# EAGLE design R111F (EAGLE 6.6.0)
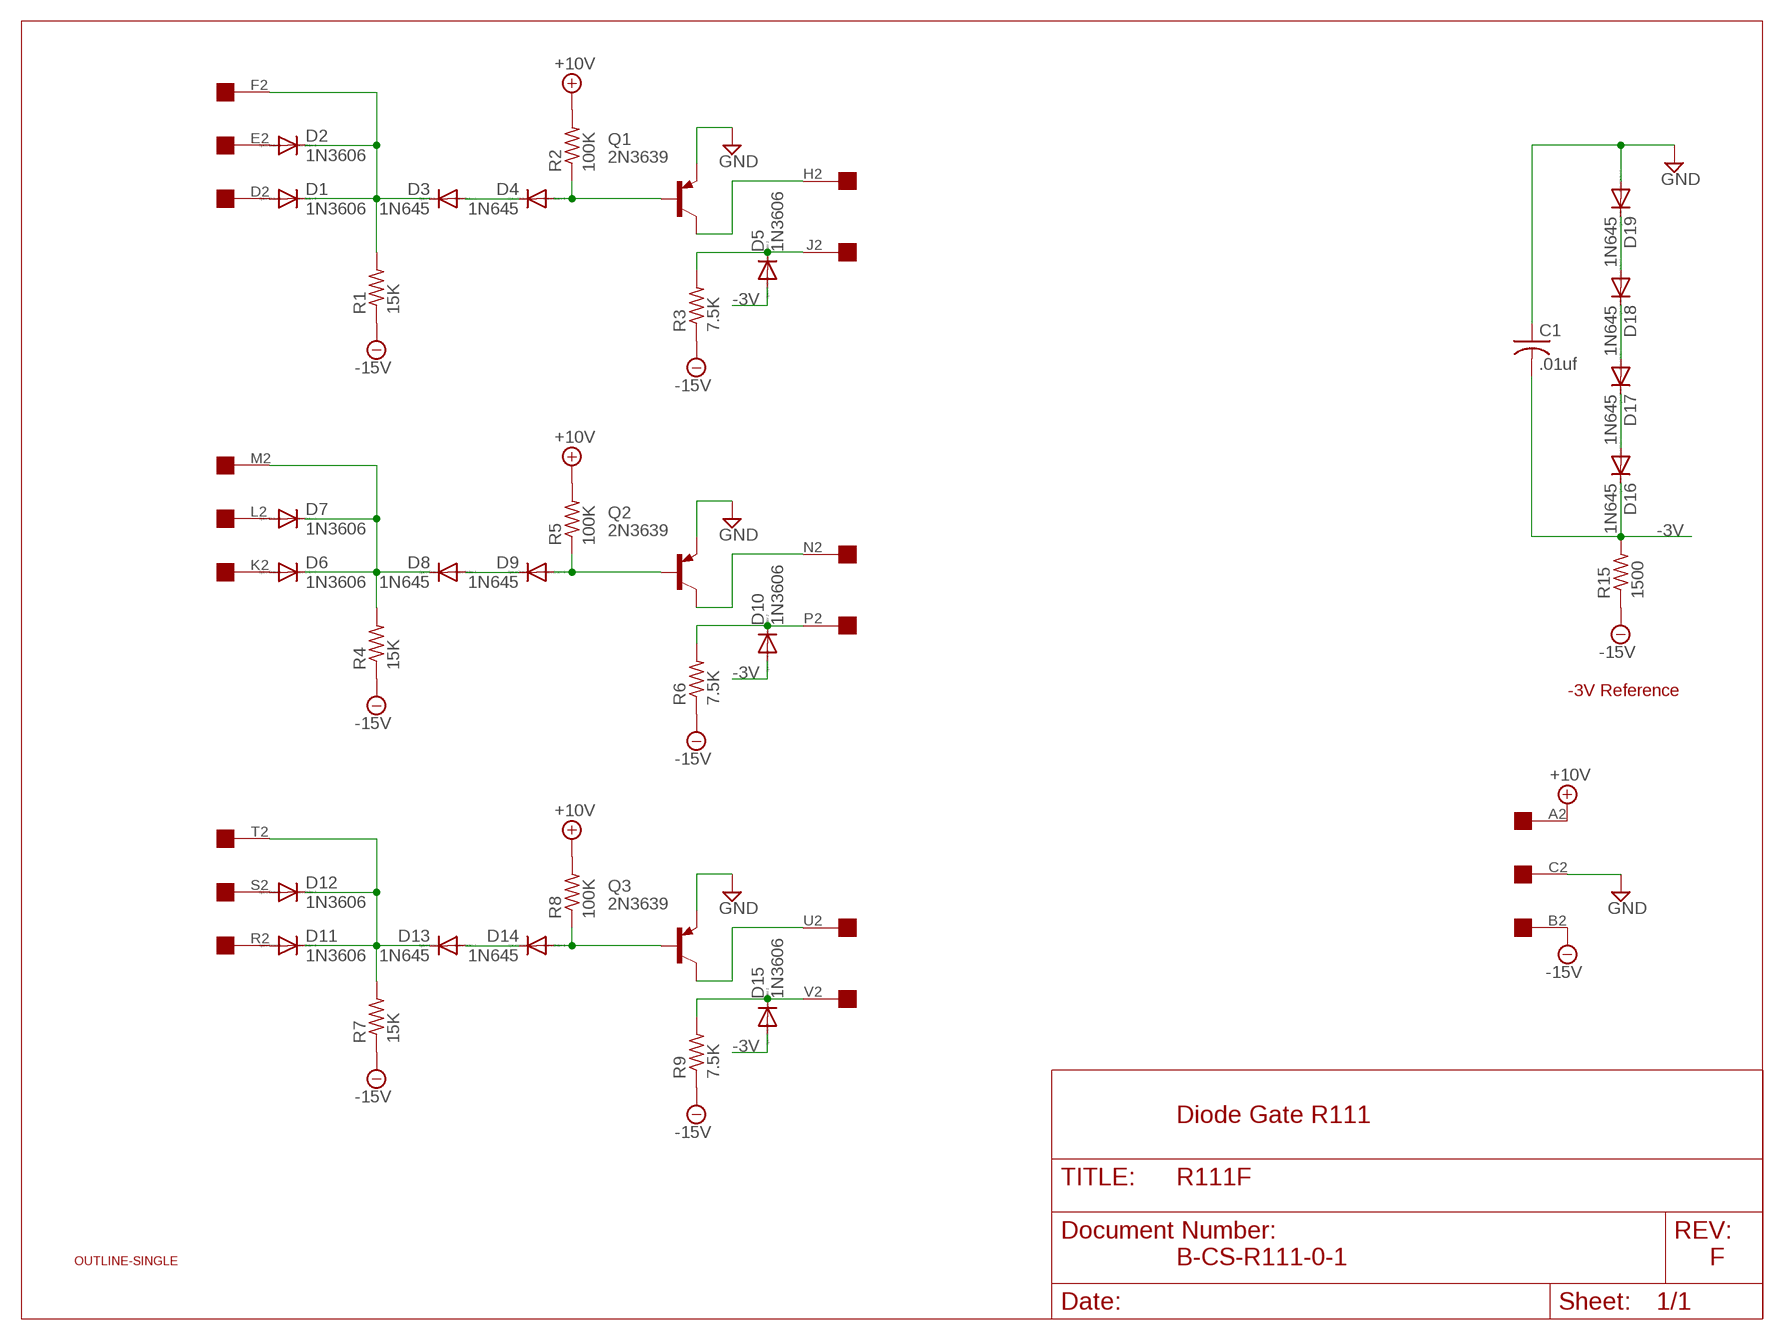
[diagram p0: schematic, sheet 1]

## Parts
C1  .01uf  C-US  [C063-025X075]
D1  1N3606  1N4148DO35-10  [DO35-10]
D2  1N3606  1N4148DO35-10  [DO35-10]
D3  1N645  1N4148DO35-10  [DO35-10]
D4  1N645  1N4148DO35-10  [DO35-10]
D5  1N3606  1N4148DO35-10  [DO35-10]
D6  1N3606  1N4148DO35-10  [DO35-10]
D7  1N3606  1N4148DO35-10  [DO35-10]
D8  1N645  1N4148DO35-10  [DO35-10]
D9  1N645  1N4148DO35-10  [DO35-10]
D10  1N3606  1N4148DO35-10  [DO35-10]
D11  1N3606  1N4148DO35-10  [DO35-10]
D12  1N3606  1N4148DO35-10  [DO35-10]
D13  1N645  1N4148DO35-10  [DO35-10]
D14  1N645  1N4148DO35-10  [DO35-10]
D15  1N3606  1N4148DO35-10  [DO35-10]
D16  1N645  1N4148DO35-10  [DO35-10]
D17  1N645  1N4148DO35-10  [DO35-10]
D18  1N645  1N4148DO35-10  [DO35-10]
D19  1N645  1N4148DO35-10  [DO35-10]
Q1  2N3639  2N3637  [TO39]
Q2  2N3639  2N3637  [TO39]
Q3  2N3639  2N3637  [TO39]
R1  15K  R-US_0207/10  [0207/10]
R2  100K  R-US_0207/10  [0207/10]
R3  7.5K  R-US_0207/10  [0207/10]
R4  15K  R-US_0207/10  [0207/10]
R5  100K  R-US_0207/10  [0207/10]
R6  7.5K  R-US_0207/10  [0207/10]
R7  15K  R-US_0207/10  [0207/10]
R8  100K  R-US_0207/10  [0207/10]
R9  7.5K  R-US_0207/10  [0207/10]
R15  1500  R-US_0207/10  [0207/10]
U$1  OUTLINE-SINGLE  [SINGLE]
U$2  EDGE-1  [EDGE-CON1]

## Nets
+10V [Power]: R2.2 R5.2 R8.2 U$2.A2
-3V [Power]: C1.2 D5.A D10.A D15.A D16.C R15.2
-15V [Power]: R1.1 R3.1 R4.1 R6.1 R7.1 R9.1 R15.1 U$2.B2
GND [Power]: C1.1 D19.A Q1.1(E) Q2.1(E) Q3.1(E) U$2.C2
N$1: D6.A U$2.K2
N$2: D9.A Q2.2(B) R5.1
N$3: D18.A D19.C
N$4: D10.C R6.2 U$2.P2
N$5: Q1.3(C) U$2.H2
N$6: D6.C D7.C D8.C R4.2 U$2.M2
N$7: D8.A D9.C
N$8: D14.A Q3.2(B) R8.1
N$9: D15.C R9.2 U$2.V2
N$10: D11.A U$2.R2
N$11: D11.C D12.C D13.C R7.2 U$2.T2
N$12: D13.A D14.C
N$13: D17.A D18.C
N$14: D7.A U$2.L2
N$15: Q2.3(C) U$2.N2
N$16: D16.A D17.C
N$17: Q3.3(C) U$2.U2
N$19: D4.A Q1.2(B) R2.1
N$20: D5.C R3.2 U$2.J2
N$21: D1.A U$2.D2
N$22: D1.C D2.C D3.C R1.2 U$2.F2
N$23: D3.A D4.C
N$31: D12.A U$2.S2
N$39: D2.A U$2.E2

## Notes on the sheet
- -3V Reference
- Diode Gate R111
- B-CS-R111-0-1 | F

## Library data of the parts
C1 = dec-con:C-US: Capacitors with funky DEC lead spacing.
D1-D19 = diode:1N4148: DIODE high speed (Philips)
Q1-Q3 = transistor-pnp:2N3637*: PNP Transistror
R1-R9 R15 = rcl:R-US_: RESISTOR, American symbol
U$1 = dec-con:OUTLINE-*: Board outlines for DEC boards.
U$2 = dec-con:EDGE-1: Single-Sided DEC Edge Connector -- (side 2)

## Net classes
1 Power: width 0.813 mm

## Board
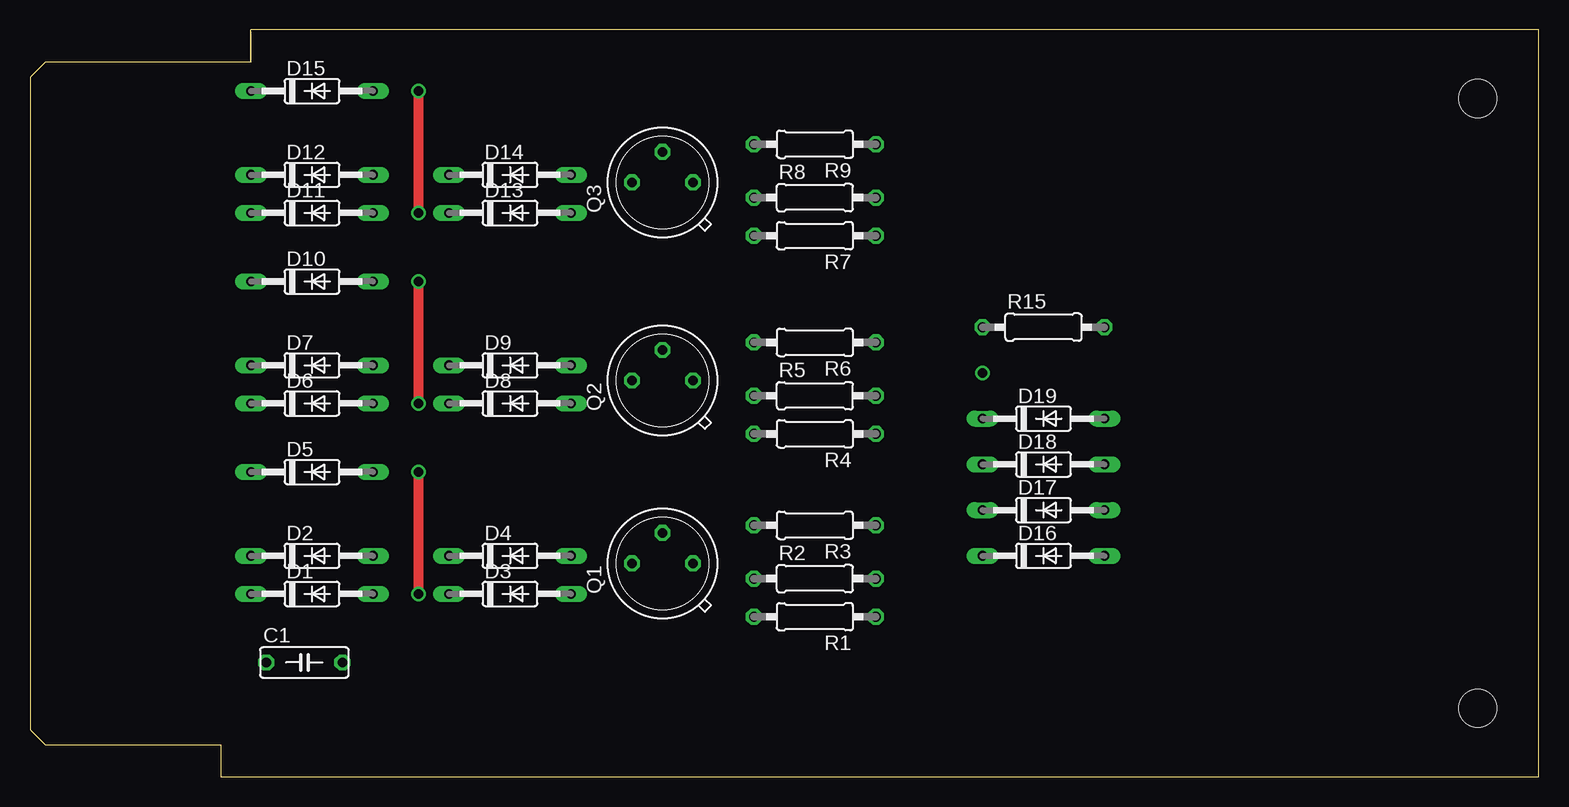
[diagram p1: board, top side]
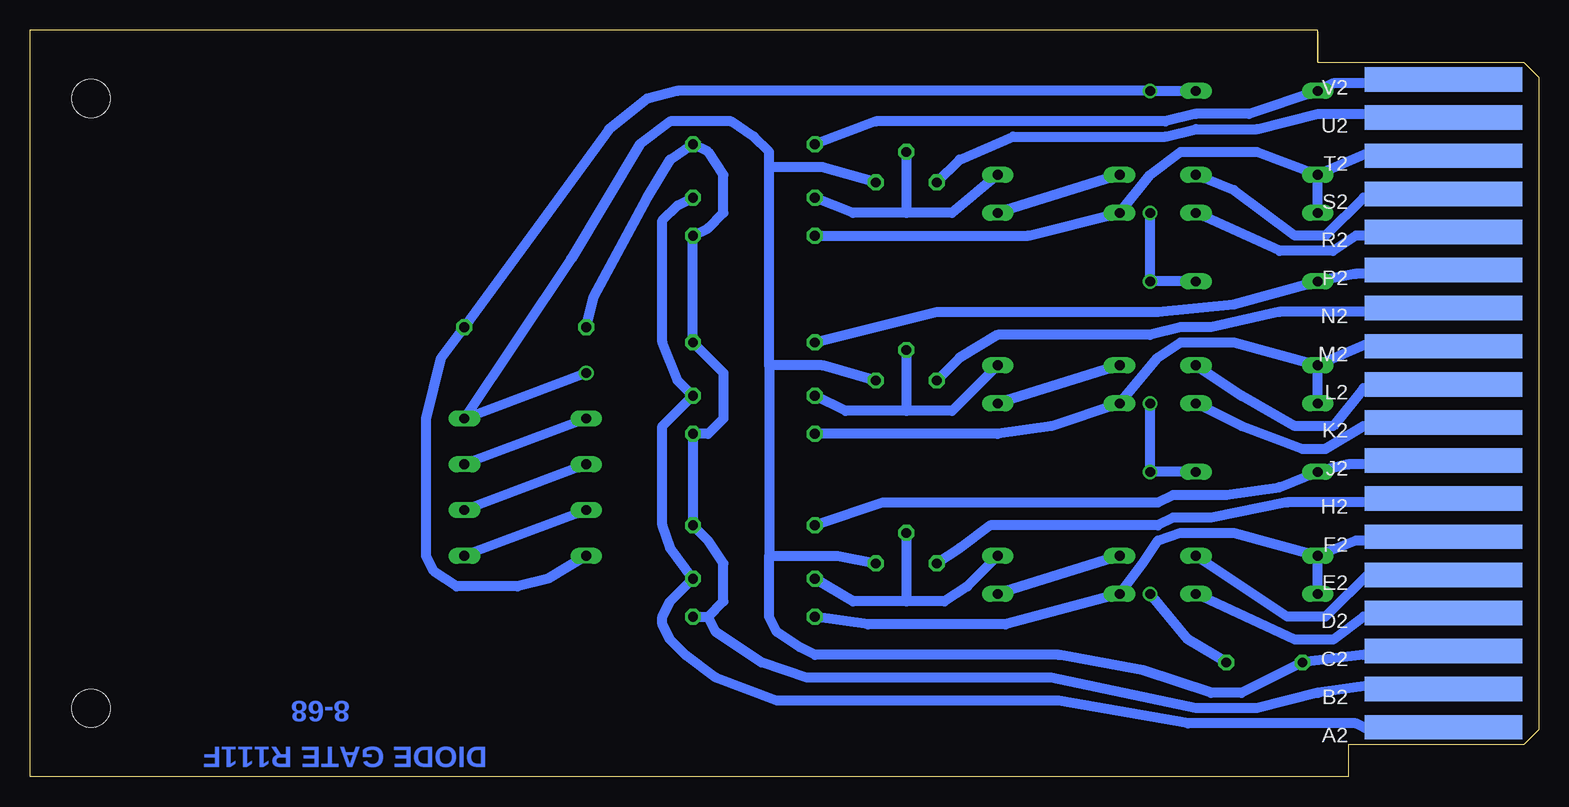
[diagram p2: board, bottom side, seen from below]

Size 125.73 x 62.23 mm. Coordinates in mm from the lower left corner, seen from the top.
Copper layers (1+16): Top 0.035mm / dielectric 1.5mm / Bottom 0.035mm
Design rules "16mils": minimum track width 16mil, minimum drill 32mil, track to track 15mil, track to pad 10mil, pad to pad 10mil, via to via 10mil, smd to smd 10mil, copper to edge 13mil, drill to drill 10mil, minimum pad ring 10mil, minimum via ring 8mil, stop-mask expansion 0mil, vias tented up to drill 0mil, thermal gap 10mil

### Footprints (pad centres in the part's own frame; a part is rotated, then mirrored left to right if it is on the bottom)
C063-025X075 = drill 0.813 octagon: 1 -2.54,0; 2 3.81,0
DO35-10 = drill 0.813 long: A 5.08,0; C -5.08,0
TO39 = drill 0.813 octagon: 1 0,-2.54; 2 2.54,0; 3 0,2.54
0207/10 = drill 0.813 octagon: 1 -5.08,0; 2 5.08,0
SINGLE = hole 3.175: 120.65,56.515; 120.65,5.715
EDGE-CON1 = smd 13.106 x 2.032 bottom: A2 7.938,4.128; B2 7.938,7.303; C2 7.938,10.477; D2 7.938,13.652; E2 7.938,16.828; F2 7.938,20.003; H2 7.938,23.177; J2 7.938,26.352; K2 7.938,29.527; L2 7.938,32.703; M2 7.938,35.877; N2 7.938,39.053; P2 7.938,42.227; R2 7.938,45.403; S2 7.938,48.578; T2 7.938,51.752; U2 7.938,54.928; V2 7.938,58.102

### Placement (x,y rotation side)
C1  22.23,9.53 0 top
D1  23.5,15.24 0 top
D2  23.5,18.41 0 top
D3  40.01,15.24 0 top
D4  40.01,18.41 0 top
D5  23.5,25.4 0 top
D6  23.5,31.11 0 top
D7  23.5,34.29 0 top
D8  40.01,31.11 0 top
D9  40.01,34.29 0 top
D10  23.5,41.27 0 top
D11  23.5,46.99 0 top
D12  23.5,50.16 0 top
D13  40.01,46.99 0 top
D14  40.01,50.16 0 top
D15  23.5,57.15 0 top
D16  84.46,18.41 0 top
D17  84.46,22.23 0 top
D18  84.46,26.04 0 top
D19  84.46,29.84 0 top
Q1  52.71,17.78 90 top
Q2  52.71,33.02 90 top
Q3  52.71,49.53 90 top
R1  65.41,13.34 180 top
R2  65.41,16.51 0 top
R3  65.41,20.95 180 top
R4  65.41,28.57 180 top
R5  65.41,31.75 0 top
R6  65.41,36.2 180 top
R7  65.41,45.09 180 top
R8  65.41,48.26 0 top
R9  65.41,52.7 180 top
R15  84.46,37.47 0 top
U$1  0,0 0 top
U$2  0,0 0 top

### Tracks (layer width: path | path; a pad name or v marks a point on that pad's centre or on a via)
+10V
  Bottom 0.813: U$2.A2 8.89,3.81 13.97,3.81 15.24,4.45 29.21,4.45 40.01,6.35 63.5,6.35 68.58,8.26 71.12,10.16 72.39,11.43 73.03,12.7 73.03,13.34 72.39,14.61 R2.2 72.39,19.05 73.03,20.95 73.03,29.21 R5.2 71.76,33.02 73.03,36.2 73.03,46.35 71.76,47.62 R8.2
-3V  (via drill 0.81)
  Top 0.813: v32.39,46.99 v32.39,57.15 | v32.39,31.11 v32.39,41.27 | v32.39,15.24 v32.39,25.4
  Bottom 0.813: D10.A v32.39,41.27 v32.39,46.99 | D15.A v32.39,57.15 71.76,57.15 74.3,56.52 77.47,53.98 82.55,46.99 R15.2 91.44,34.92 92.71,29.84 92.71,18.41 92.08,17.14 90.17,15.88 85.09,15.88 82.55,16.51 D16.C | D5.A v32.39,25.4 v32.39,31.11 | C1.2 29.21,11.43 v32.39,15.24
-15V
  Bottom 0.813: R1.1 69.22,13.34 | 69.22,13.34 67.95,14.61 67.95,17.78 69.22,19.68 R3.1 R4.1 69.22,28.57 67.95,29.84 67.95,33.66 R6.1 R7.1 69.22,45.72 67.95,46.99 67.95,50.16 69.22,52.07 R9.1 72.39,51.44 74.3,48.26 78.74,40.01 R15.1 | U$2.B2 10.8,7.62 13.97,7.62 18.42,6.99 23.5,5.71 28.58,5.71 40.64,8.26 60.96,8.26 64.77,9.53 68.58,12.06 69.22,13.34
GND  (via drill 0.81)
  Bottom 0.813: v79.38,33.66 D19.A 80.65,43.18 74.93,52.7 72.39,54.61 67.31,54.61 65.41,53.34 64.14,52.07 64.14,50.8 | U$2.C2 8.89,10.16 14.61,10.16 C1.1 24.77,6.99 27.31,6.99 33.02,8.89 40.01,10.16 60.33,10.16 61.6,10.79 63.5,12.06 64.14,13.34 64.14,18.41 | 64.14,18.41 58.42,18.41 Q1.1 | Q3.1 59.69,50.8 64.14,50.8 | Q2.1 59.69,34.29 64.14,34.29 | 64.14,34.29 64.14,50.8 | 64.14,34.29 64.14,18.41
N$1
  Bottom 0.813: U$2.K2 8.89,29.21 14.61,29.21 17.78,27.3 19.69,27.3 24.77,29.21 D6.A
N$2
  Bottom 0.813: D9.A 48.9,30.48 52.71,30.48 | 52.71,30.48 57.79,30.48 R5.1 | Q2.2 52.71,30.48
N$3
  Bottom 0.813: D19.C D18.A
N$4
  Bottom 0.813: R6.2 50.17,38.73 31.75,38.73 25.4,39.37 D10.C 15.24,41.91 9.53,41.91 U$2.P2
N$5
  Bottom 0.813: U$2.H2 8.89,22.86 20.96,22.86 27.31,21.59 30.48,21.59 31.75,20.95 45.72,20.95 48.26,19.05 Q1.3
N$6
  Bottom 0.813: D6.C D7.C | U$2.M2 9.53,36.2 13.97,36.2 D7.C | D7.C 25.4,36.2 29.85,36.2 31.75,34.92 D8.C 40.64,29.21 45.09,28.57 R4.2
N$7
  Bottom 0.813: D9.C D8.A
N$8
  Bottom 0.813: Q3.2 52.71,46.99 | 52.71,46.99 57.15,46.99 R8.1 | D14.A 48.9,46.99 52.71,46.99
N$9
  Bottom 0.813: U$2.V2 9.53,57.78 17.15,57.78 D15.C 24.13,55.24 28.58,55.24 31.12,54.61 55.25,54.61 R9.2
N$10
  Bottom 0.813: U$2.R2 8.26,45.09 15.24,45.09 17.15,43.81 21.59,43.81 D11.A
N$11
  Bottom 0.813: D11.C D12.C | U$2.T2 8.89,52.07 13.97,52.07 D12.C | D12.C 23.5,52.07 29.85,52.07 32.39,50.16 D13.C 42.55,45.09 R7.2
N$12
  Bottom 0.813: D14.C D13.A
N$13
  Bottom 0.813: D18.C D17.A
N$14
  Bottom 0.813: U$2.L2 8.26,32.38 14.61,32.38 17.15,29.21 20.32,29.21 24.77,31.75 D7.A
N$15
  Bottom 0.813: U$2.N2 9.53,38.73 21.59,38.73 27.31,37.47 29.85,37.47 32.39,36.83 45.09,36.83 48.26,34.92 Q2.3
N$16
  Bottom 0.813: D17.C D16.A
N$17
  Bottom 0.813: Q3.3 48.26,51.44 43.82,53.34 31.12,53.34 28.58,53.98 23.5,53.98 18.42,55.24 8.89,55.24 U$2.U2
N$19
  Bottom 0.813: D4.A 47.63,15.88 49.53,14.61 52.71,14.61 | 52.71,14.61 57.15,14.61 R2.1 | Q1.2 52.71,14.61
N$20
  Bottom 0.813: R3.2 54.61,22.86 31.75,22.86 30.48,23.5 26.04,23.5 21.59,24.13 D5.C 15.88,26.04 10.16,26.04 U$2.J2
N$21
  Bottom 0.813: U$2.D2 9.53,13.34 14.61,13.34 17.15,11.43 20.32,11.43 D1.A
N$22
  Bottom 0.813: R1.2 55.88,12.7 44.45,12.7 D3.C 33.02,17.78 31.75,19.68 29.85,20.32 25.4,20.32 D2.C | D1.C D2.C | U$2.F2 10.16,19.68 15.24,19.68 D2.C
N$23
  Bottom 0.813: D4.C D3.A
N$31
  Bottom 0.813: U$2.S2 8.26,48.26 14.61,48.26 17.78,45.09 20.32,45.09 25.4,48.9 D12.A
N$39
  Bottom 0.813: U$2.E2 8.26,17.14 13.97,17.14 17.78,13.34 20.96,13.34 D2.A

### Text on the board
Bottom: 8-68 | DIODE GATE R111F